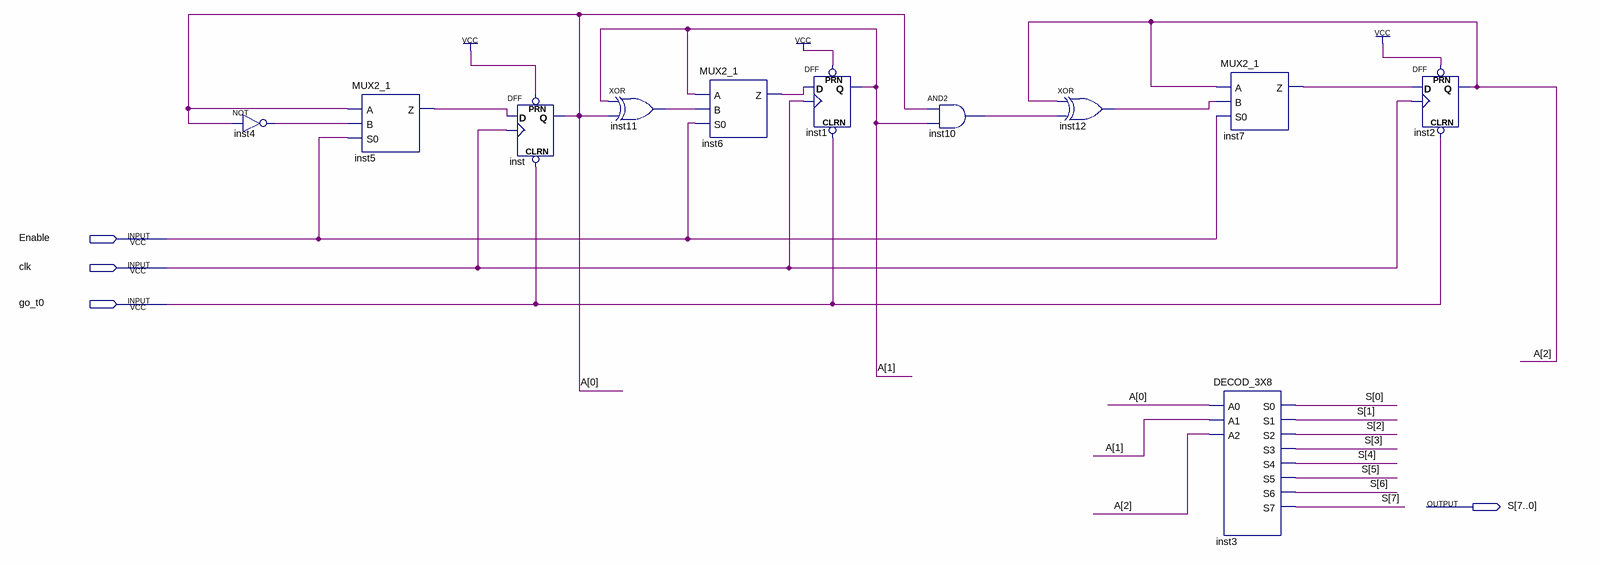
[diagram p0: schematic sheet]
// Quartus schematic TEMP.bdf as structural Verilog: 11 symbols, 4 pins
module TEMP (
  input  Enable,
  input  clk,
  input  go_t0,
  output [7:0] S
);

  wire inst4_out, inst5_z, inst6_z, inst7_z, inst10_out, inst11_out, inst12_out;
  wire [2:0] A;

  not inst4 (inst4_out, A[0]);
  MUX2_1 inst5 (.A(A[0]), .B(inst4_out), .S0(Enable), .Z(inst5_z));
  DFF inst (.CLRN(go_t0), .CLK(clk), .D(inst5_z), .PRN(1'b1), .Q(A[0]));
  xor inst11 (inst11_out, A[1], A[0]);
  MUX2_1 inst6 (.A(A[1]), .B(inst11_out), .S0(Enable), .Z(inst6_z));
  DFF inst1 (.CLRN(go_t0), .CLK(clk), .D(inst6_z), .PRN(1'b1), .Q(A[1]));
  and inst10 (inst10_out, A[0], A[1]);
  xor inst12 (inst12_out, A[2], inst10_out);
  MUX2_1 inst7 (.A(A[2]), .B(inst12_out), .S0(Enable), .Z(inst7_z));
  DECOD_3X8 inst3 (
    .A0(A[0]), .A1(A[1]), .A2(A[2]), .S0(S[0]), .S1(S[1]), .S2(S[2]), .S3(S[3]), .S4(S[4]), .S5(S[5]),
    .S6(S[6]), .S7(S[7]));
  DFF inst2 (.CLRN(go_t0), .CLK(clk), .D(inst7_z), .PRN(1'b1), .Q(A[2]));
endmodule
